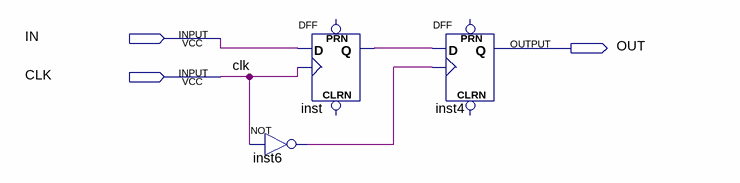
[diagram p0: schematic sheet]
// Quartus schematic test.bdf as structural Verilog: 3 symbols, 3 pins
module test (
  input  IN,
  input  CLK,
  output OUT
);

  wire inst6_out, inst_q;

  DFF inst (.CLK(CLK), .D(IN), .Q(inst_q));  // open: CLRN, PRN
  not inst6 (inst6_out, CLK);
  DFF inst4 (.CLK(inst6_out), .D(inst_q), .Q(OUT));  // open: CLRN, PRN
endmodule
